# EAGLE schematic 03A-001 (EAGLE 6.3)
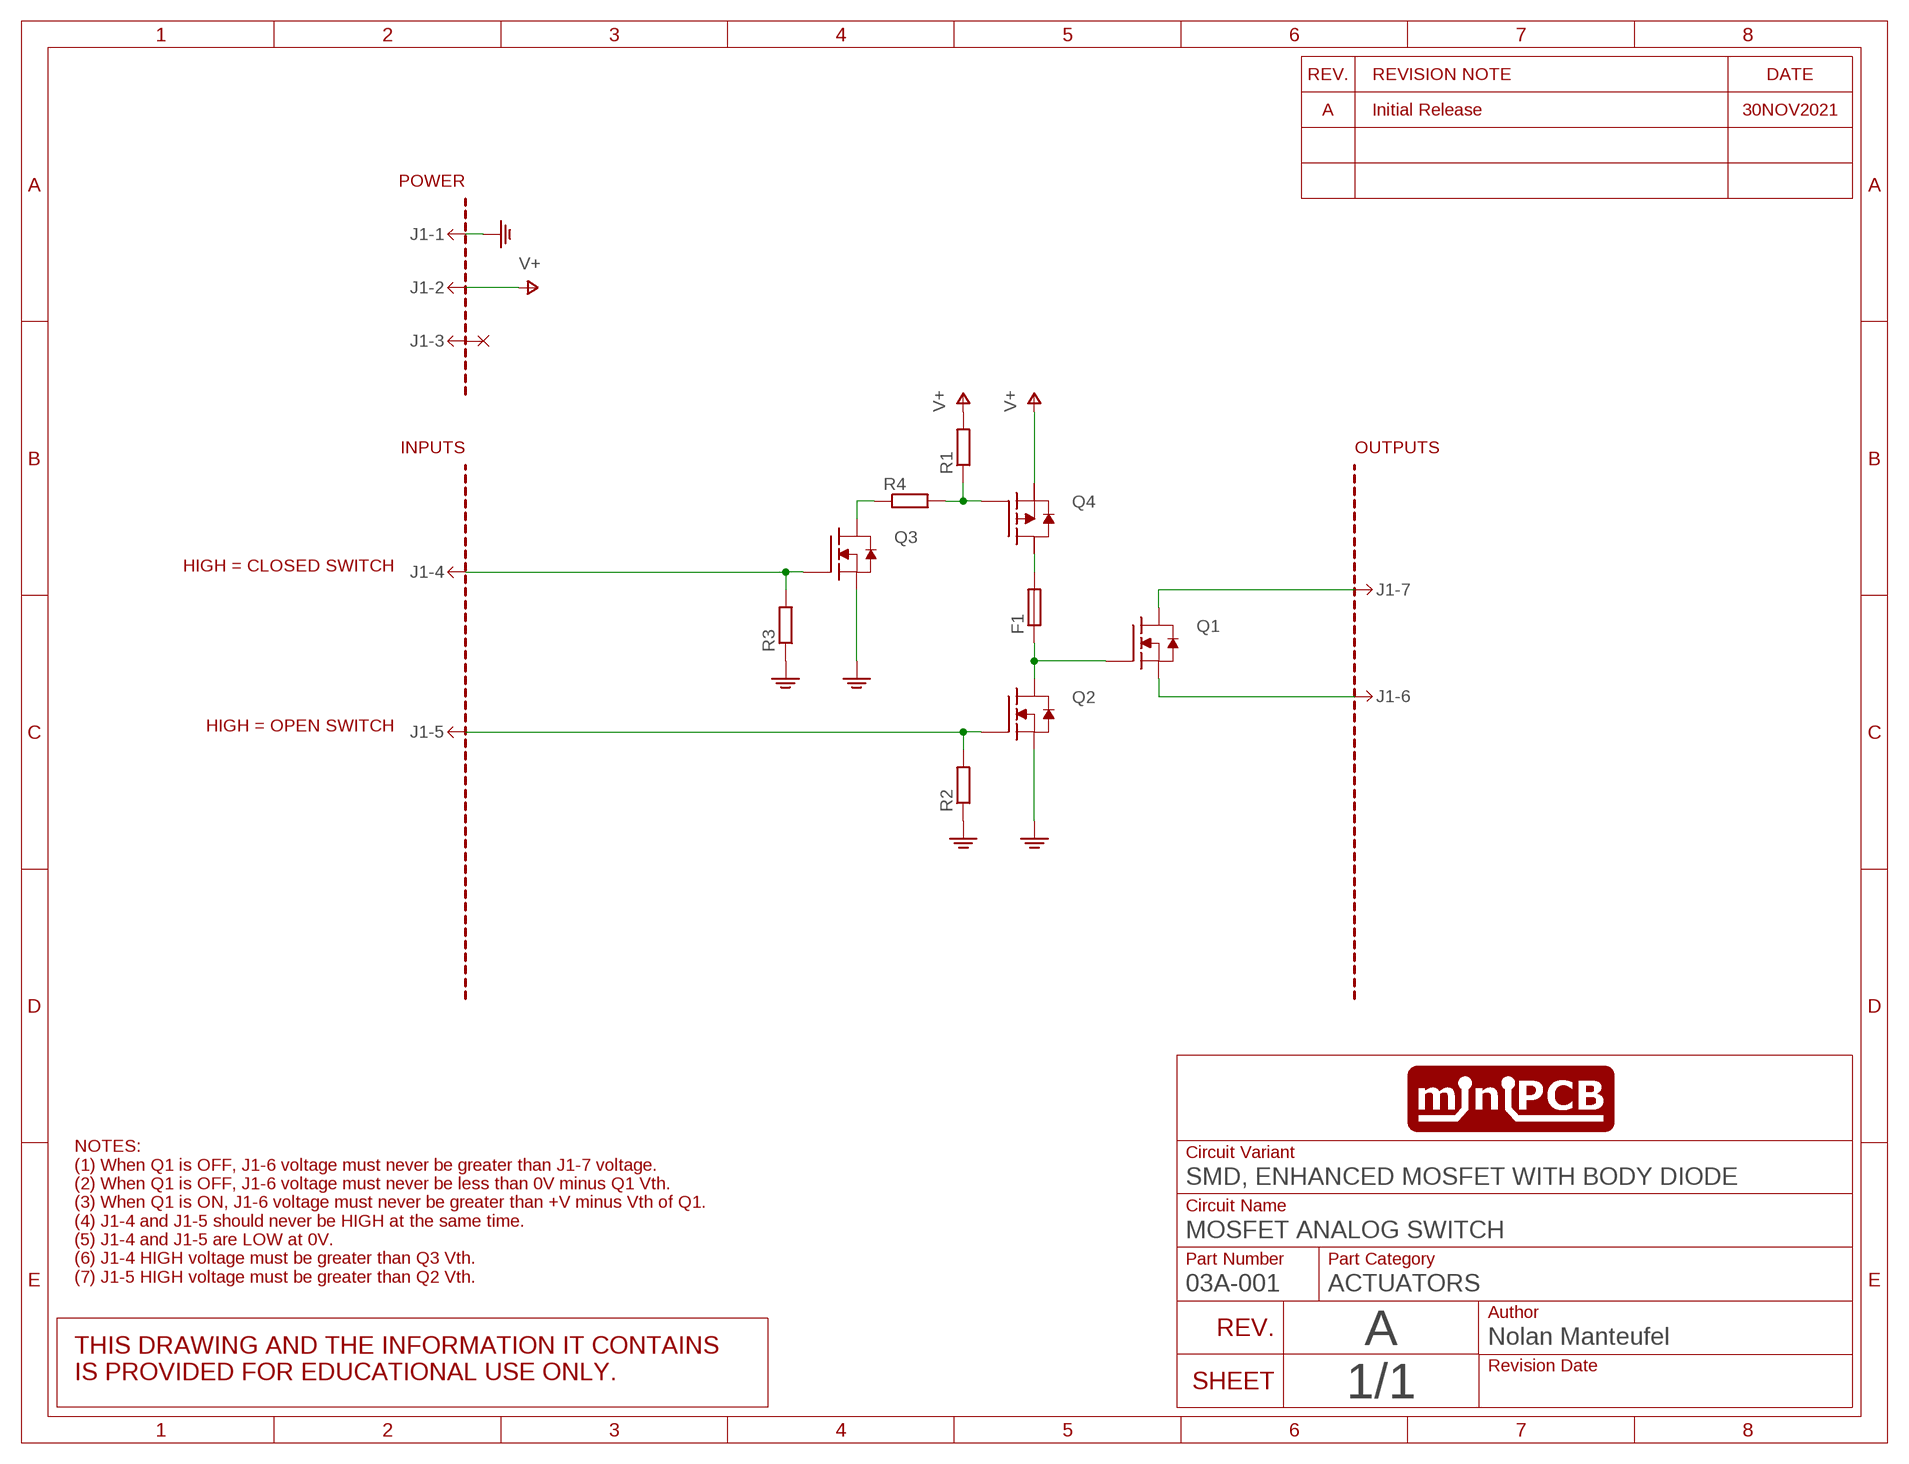
[diagram p0: schematic, sheet 1]
SHEET1 (SCHEMATIC): CIRCUIT_CATEGORY: ACTUATORS; CIRCUIT_NAME: MOSFET ANALOG SWITCH; REVISION: A

## Parts
F1  FUSE0805  [F0805]
J1-  MINIPCB_7P25  [MINIPCB_7P_25X25MM]
Q1  MOSFET-NSOT23  [SOT23]
Q2  MOSFET-NSOT23  [SOT23]
Q3  MOSFET-NSOT23  [SOT23]
Q4  MOSFET-PNTR2101PT1G  [SOT23]
R1  RESISTORSMD  [R0805]
R2  RESISTORSMD  [R0805]
R3  RESISTORSMD  [R0805]
R4  RESISTORSMD  [R0805]

## Nets
GND: J1-.1 Q2.2(S) Q3.2(S) R2.1 R3.1
N$1: Q4.1(G) R1.1 R4.2
N$2: F1.1 Q1.1(G) Q2.3(D)
N$3: F1.2 Q4.2(D)
N$4: J1-.6 Q1.2(S)
N$5: J1-.7 Q1.3(D)
N$6: J1-.5 Q2.1(G) R2.2
N$7: J1-.4 Q3.1(G) R3.2
N$8: Q3.3(D) R4.1
V+: J1-.2 Q4.3(S) R1.2
Unconnected: J1-.3

## Notes on the sheet
- 30NOV2021
- HIGH = CLOSED SWITCH
- HIGH = OPEN SWITCH
- NOTES:
  (1) When Q1 is OFF, J1-6 voltage must never be greater than J1-7 voltage.
  (2) When Q1 is OFF, J1-6 voltage must never be less than 0V minus Q1 Vth.
  (3) When Q1 is ON, J1-6 voltage must never be greater than +V minus Vth of Q1.
  (4) J1-4 and J1-5 should never be HIGH at the same time.
  (5) J1-4 and J1-5 are LOW at 0V.
  (6) J1-4 HIGH voltage must be greater than Q3 Vth.
  (7) J1-5 HIGH voltage must be greater than Q2 Vth.

## Library data of the parts
F1 = minipcb:FUSE
J1- = minipcb:MINIPCB_7P; REVISION: A
Q1-Q3 = minipcb:MOSFET-N
Q4 = minipcb:MOSFET-P
R1-R4 = minipcb:RESISTOR